# Altium schematic sheet Schematic.SchDoc
size 292 x 193 mm
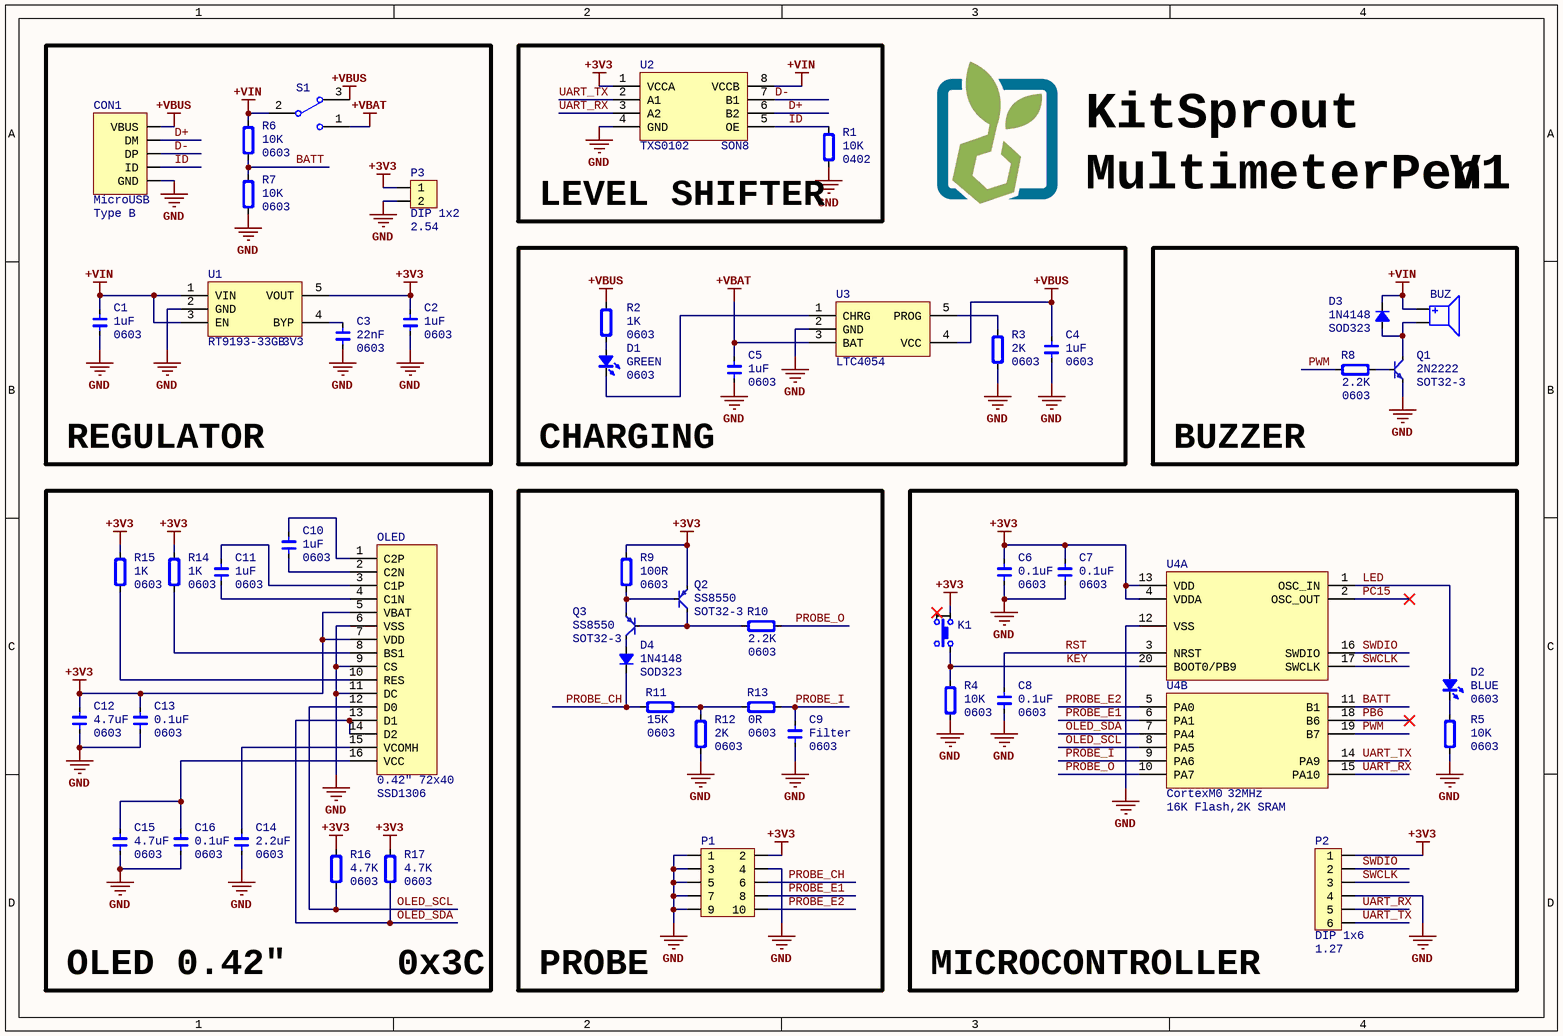
[diagram p0: Schematic.SchDoc]

## Parts
BUZ  Buzzer  [Buzzer_5x5]  (value not drawn)
C1  value 1uF  Type: 0603  [CAP_0603]  (hidden comment: C0603)
C2  value 1uF  Type: 0603  [CAP_0603]  (hidden comment: C0603)
C3  value 22nF  Type: 0603  [CAP_0603]  (hidden comment: C0603)
C4  value 1uF  Type: 0603  [CAP_0603]  (hidden comment: C0603)
C5  value 1uF  Type: 0603  [CAP_0603]  (hidden comment: C0603)
C6  value 0.1uF  Type: 0603  [CAP_0603]  (hidden comment: C0603)
C7  value 0.1uF  Type: 0603  [CAP_0603]  (hidden comment: C0603)
C8  value 0.1uF  Type: 0603  [CAP_0603]  (hidden comment: C0603)
C9  value Filter  Type: 0603  [CAP_0603]  (hidden comment: C0603)
C10  value 1uF  Type: 0603  [CAP_0603]  (hidden comment: C0603)
C11  value 1uF  Type: 0603  [CAP_0603]  (hidden comment: C0603)
C12  value 4.7uF  Type: 0603  [CAP_0603]  (hidden comment: C0603)
C13  value 0.1uF  Type: 0603  [CAP_0603]  (hidden comment: C0603)
C14  value 2.2uF  Type: 0603  [CAP_0603]  (hidden comment: C0603)
C15  value 4.7uF  Type: 0603  [CAP_0603]  (hidden comment: C0603)
C16  value 0.1uF  Type: 0603  [CAP_0603]  (hidden comment: C0603)
CON1  MicroUSB  value Type B  [USB_Micro-AB]
D1  value GREEN  Type: 0603  [LED_0603_GREEN]  (hidden comment: D0603)
D2  value BLUE  Type: 0603  [LED_0603_BLUE]  (hidden comment: D0603)
D3  Type: SOD323  [SOD-323]  (hidden comment: 1N4148)
D4  Type: SOD323  [SOD-323]  (hidden comment: 1N4148)
K1  TACT  [ButtonTACT_3.4*3.5_90]  (value not drawn)
OLED  value 0.42" 72x40  Note: SSD1306  [OLED_0.42_72x40_SSD1306]  (hidden comment: OLED_0.42_SSD1306)
P1  HDR2x5  [HDR2X5_2.54_180HF]  (value not drawn)
P2  value 1.27  Type: DIP 1x6  [HDR1X6_1.27_180F]  (hidden comment: HDR1x6)
P3  value 2.54  Type: DIP 1x2  [HDR1X2_2.54_180H]  (hidden comment: HDR1x2)
Q1  Type: SOT32-3  [SOT23-3]  (hidden comment: 2N2222)
Q2  Type: SOT32-3  [SOT23-3]  (hidden comment: SS8550)
Q3  Type: SOT32-3  [SOT23-3]  (hidden comment: SS8550)
R1  value 10K  Type: 0402  [RES_0402]  (hidden comment: R0402)
R2  value 1K  Type: 0603  [RES_0603]  (hidden comment: R0603)
R3  value 2K  Type: 0603  [RES_0603]  (hidden comment: R0603)
R4  value 10K  Type: 0603  [RES_0603]  (hidden comment: R0603)
R5  value 10K  Type: 0603  [RES_0603]  (hidden comment: R0603)
R6  value 10K  Type: 0603  [RES_0603]  (hidden comment: R0603)
R7  value 10K  Type: 0603  [RES_0603]  (hidden comment: R0603)
R8  value 2.2K  Type: 0603  [RES_0603]  (hidden comment: R0603)
R9  value 100R  Type: 0603  [RES_0603]  (hidden comment: R0603)
R10  value 2.2K  Type: 0603  [RES_0603]  (hidden comment: R0603)
R11  value 15K  Type: 0603  [RES_0603]  (hidden comment: R0603)
R12  value 2K  Type: 0603  [RES_0603]  (hidden comment: R0603)
R13  value 0R  Type: 0603  [RES_0603]  (hidden comment: R0603)
R14  value 1K  Type: 0603  [RES_0603]  (hidden comment: R0603)
R15  value 1K  Type: 0603  [RES_0603]  (hidden comment: R0603)
R16  value 4.7K  Type: 0603  [RES_0603]  (hidden comment: R0603)
R17  value 4.7K  Type: 0603  [RES_0603]  (hidden comment: R0603)
S1  SPDT  [SwitchSPDT_2.8X6.6_90]  (value not drawn)
U1  RT9193-33GB  value 3V3  [SOT23-5]
U2  TXS0102  Type: SON8  [SON_P0.35_8]
U3  LTC4054  [SOT23-5]
U4  STM32L011F4U6  [QFN_P0.5_20]  (value not drawn)  (parts A,B of 2)

## Blocks framed on the sheet
REGULATOR: C1-C3 CON1 P3 R6 R7 S1 U1
LEVEL SHIFTER: R1 U2
CHARGING: C4 C5 D1 R2 R3 U3
BUZZER: BUZ D3 Q1 R8
PROBE: C9 D4 P1 Q2 Q3 R9-R13
MICROCONTROLLER: C6-C8 D2 K1 P2 R4 R5 U4

## Nets
+3V3: C2.2 C6.2 C7.2 C12.2 C13.2 K1.1 OLED.5(VBAT) OLED.7(VDD) P1.2 P2.1 P3.1 Q2.2(E) R9.2 R14.2 R15.2 R16.2 R17.2 U1.5(VOUT) U2.1(VCCA) U4.4(VDDA) U4.13(VDD)
+VBAT: C5.2 S1.1 U3.3(BAT)
+VBUS: C4.2 CON1.1(VBUS) R2.2 S1.3 U3.4(VCC)
+VIN: BUZ.P(Positive) C1.2 D3.2(K) R6.2 S1.2 U1.1(VIN) U1.3(EN) U2.8(VCCB)
GND: C1.1 C2.1 C3.1 C4.1 C5.1 C6.1 C7.1 C8.1 C9.1 C12.1 C13.1 C14.1 C15.1 C16.1 CON1.5(GND) OLED.6(VSS) OLED.9(CS) OLED.11(DC) P1.1 P1.3 P1.4 P1.5 P1.7 P1.9 P2.4 P3.2 Q1.2(E) R1.1 R3.1 R4.1 R5.1 R7.1 R12.1 U1.2(GND) U2.4(GND) U3.2(GND) U4.12(VSS)
BATT: R6.1 R7.2 U4.11(B1)
D+: CON1.2(DM) U2.6(B2)
D-: CON1.3(DP) U2.7(B1)
ID: CON1.4(ID) R1.2 U2.5(OE)
KEY: K1.2 R4.2 U4.20(BOOT0/PB9)
LED: D2.1(A) U4.1(OSC_IN)
OLED_SCL: OLED.12(D0) R16.1 U4.8(PA5)
OLED_SDA: OLED.13(D1) OLED.14(D2) R17.1 U4.7(PA4)
PB6: U4.18(B6)
PC15: U4.2(OSC_OUT)
PROBE_CH: D4.2(K) P1.6 R11.2
PROBE_E1: P1.8 U4.6(PA1)
PROBE_E2: P1.10 U4.5(PA0)
PROBE_I: C9.2 R13.1 U4.9(PA6)
PROBE_O: R10.1 U4.10(PA7)
PWM: R8.2 U4.19(B7)
RST: C8.2 U4.3(NRST)
SWCLK: P2.3 U4.17(SWCLK)
SWDIO: P2.2 U4.16(SWDIO)
UART_RX: P2.5 U2.3(A2) U4.15(PA10)
UART_TX: P2.6 U2.2(A1) U4.14(PA9)
NetBUZ_N: BUZ.N(Negative) D3.1(A) Q1.3(C)
NetC3_2: C3.2 U1.4(BYP)
NetC10_1: C10.1 OLED.2(C2N)
NetC10_2: C10.2 OLED.1(C2P)
NetC11_1: C11.1 OLED.4(C1N)
NetC11_2: C11.2 OLED.3(C1P)
NetC14_2: C14.2 OLED.15(VCOMH)
NetC15_2: C15.2 C16.2 OLED.16(VCC)
NetD1_1: D1.1(A) R2.1
NetD1_2: D1.2(K) U3.1(CHRG)
NetD2_2: D2.2(K) R5.2
NetD4_1: D4.1(A) Q3.3(C)
NetOLED_8: OLED.8(BS1) R14.1
NetOLED_10: OLED.10(RES) R15.1
NetQ1_1: Q1.1(B) R8.1
NetQ2_1: Q2.1(B) Q3.2(E) R9.1
NetQ2_3: Q2.3(C) Q3.1(B) R10.2
NetR3_2: R3.2 U3.5(PROG)
NetR11_1: R11.1 R12.2 R13.2

Not connected (* = marked no-connect by the designer): CON1 0(SH); K1 3*

## Notes on the sheet
- KitSprout
- MultimeterPen
- V1
- OLED 0.42"
- 0x3C
- Title
- Size:
- Date:
- A4
- Number:
- Time:
- Revision:
- Sheet
- of
- File:

## Library data of the parts
C1-C16 = Cap_0603: Capacitor; Specification: X7R, ±10%, 16V; Note: ±10%; Manufacturer: *
CON1 = USB_Micro: USB; Type: *
D1 D2 = LED_0603: LED
D3 D4 = Diode_SOD323: Diode; Manufacturer: *; Specification: *; Note: *; Value: 1N4148
K1 = ButtonTACT_90_3.4x3.5: Button; value: 3.4x3.5mm; type: TACT 4P; Link: https://item.taobao.com/item.htm?spm=a1z0d.6639537.1997196601.53.23d65886vmE4xA&id=524943251643
OLED = OLED_0.42_SSD1306: OLED; Specification: 0.65mm; Type: FPC16; Manufacturer: *; Link: https://item.taobao.com/item.htm?spm=a1z09.2.0.0.4fdb2e8dEz3Swn&id=556201228621&_u=ik3v2nv8c8e
P1 = HDR2x5_2.54: Header
P2 = HDR1x6_1.27T: Header
P3 = HDR1x2_2.54: Header
Q1 = BJT_NPN: Transistor; Note: NPN; Manufacturer: *; Specification: *; Value: 2N2222
Q2 = BJT_PNP: Transistor; Note: PNP; Manufacturer: *; Specification: *; Value: SS8550
Q3 = BJT_PNP_T: Transistor; Note: PNP; Manufacturer: *; Specification: *; Value: SS8550
R1 = Res_0402: Resistor; Specification: ±1%; Manufacturer: *; Note: ±1%
R2-R17 = Res_0603: Resistor; Specification: ±1%; Manufacturer: *; Note: ±1%
S1 = SwitchSPDT_90_2.8x6.6: Switch; Value: 2.8x6.6mm; Type: SPDT 3P; Link: *
U1 = RT9193: Power; Type: SOT23-5; Manufacturer: *; Specification: *; Note: *
U2 = TXS0102: Level Shifter; Manufacturer: Texas Instruments; Value: 2-Bit; Specification: *; Note: *; ComponentLink1Description: Datasheet; ComponentLink1URL: https://www.ti.com/lit/ds/symlink/txs0102.pdf?&ts=1589954619766
U3 = LTC4054: Battery Charger; Type: SOT23-5
U4 = STM32L011F: MCU ST; Manufacturer: STMicroelectronics; Value: 32MHz; Note: CortexM0; Specification: 16K Flash,2K SRAM; Type: TSSOP20; Datasheet: https://www.st.com/resource/en/datasheet/stm32f030f4.pdf
BUZ = Buzzer: Value: *; Type: SMD3; Link: https://item.taobao.com/item.htm?spm=a1z0d.6639537.1997196601.13.23d65886vmE4xA&id=599696064098